# Altium project Resonator filter design.PrjPcb
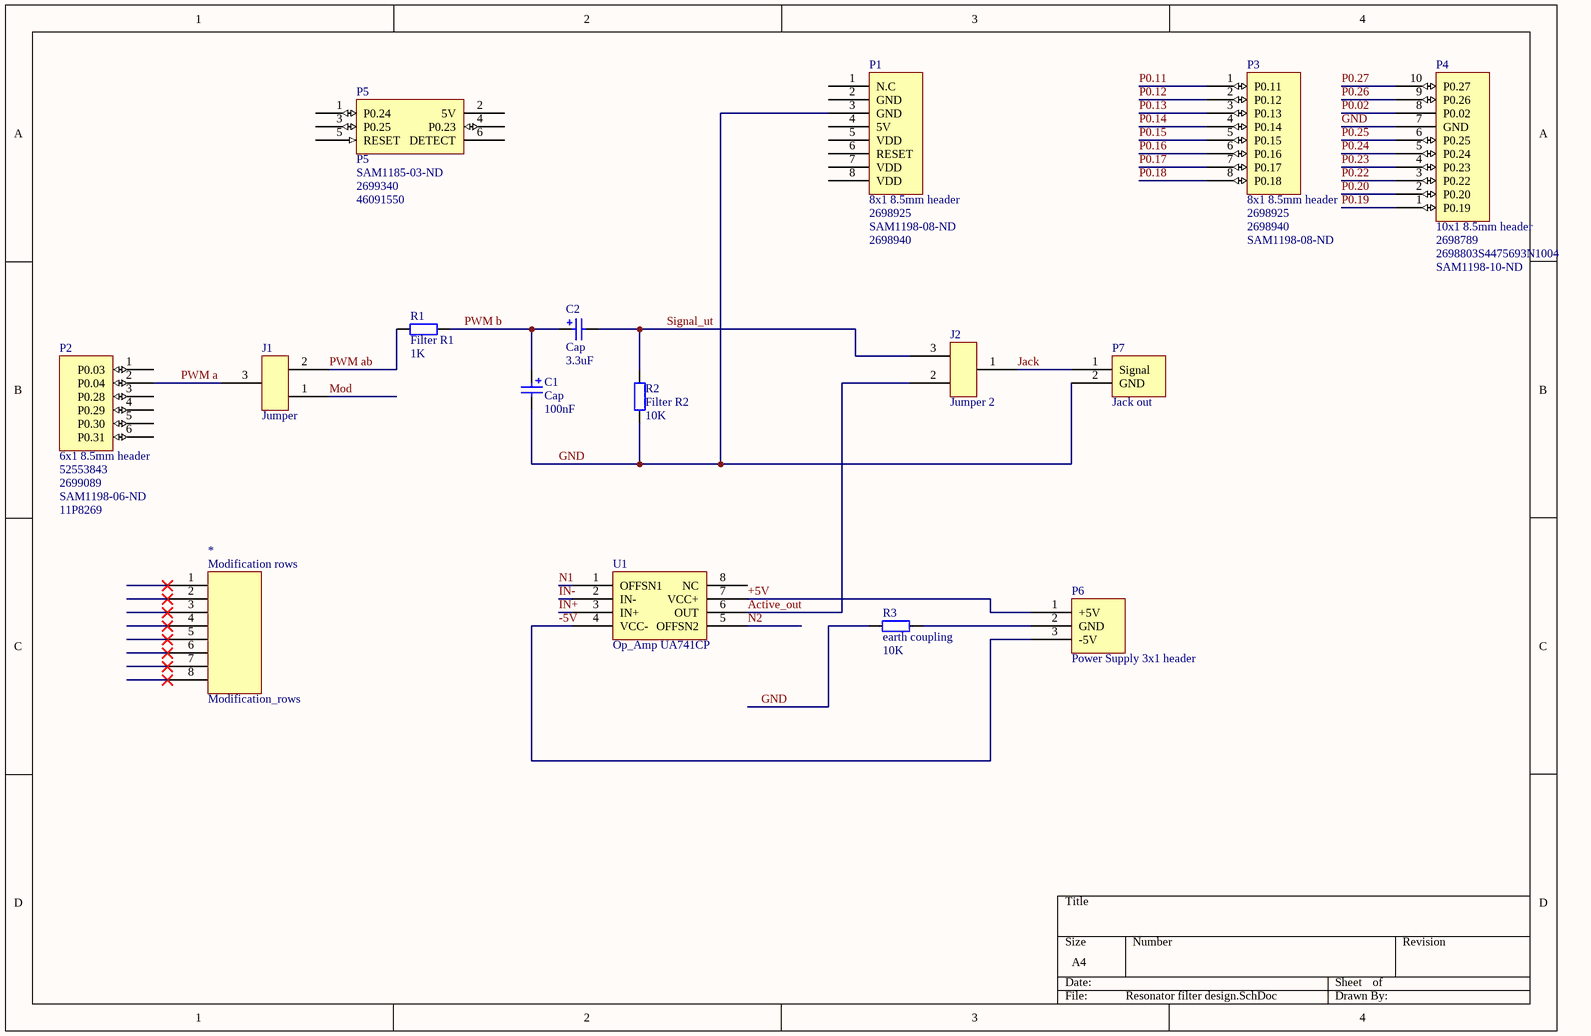
[diagram p0: Resonator filter design.SchDoc]
1 sheet, 16 parts. Net scope: global (net labels, ports and power ports of the same name join across sheets).
Board file: Resonator filter design.PcbDoc

## Sheet Resonator filter design.SchDoc
size A4

### Parts
*  Modification_rows
C1  Cap  value 100nF  [Cap 100nF]
C2  Cap  value 3.3uF  [Cap 3.3uF]
J1  Jumper  [Jumper]
J2  Jumper 2  [Jumper2]
P1  8x1 8.5mm header  Supplier Part Number 1: 2698925  Supplier Part Number 2: SAM1198-08-ND  Supplier Part Number 3: 2698940  [Header 8x1 8.5mm]
P2  6x1 8.5mm header  Supplier Part Number 1: 52553843  Supplier Part Number 2: 2699089  Supplier Part Number 3: SAM1198-06-ND  Supplier Part Number 4: 11P8269  [Header 6x1 8.5mm]
P3  8x1 8.5mm header  Supplier Part Number 1: 2698925  Supplier Part Number 2: 2698940  Supplier Part Number 3: SAM1198-08-ND  [Header 8x1 8.5mm]
P4  10x1 8.5mm header  Supplier Part Number 1: 2698789  Supplier Part Number 2: 2698803S4475693N1004  Supplier Part Number 3: SAM1198-10-ND  [Header 10x1 8.5mm]
P5  P5  Supplier Part Number 1: SAM1185-03-ND  Supplier Part Number 2: 2699340  Supplier Part Number 3: 46091550  [ICSP]
P6  Power Supply 3x1 header  [Power Supply connector]
P7  Jack out  [Jack out]
R1  Filter R1  value 1K  [AXIAL-0.4]
R2  Filter R2  value 10K  [AXIAL-0.4]
R3  earth coupling  value 10K  [AXIAL-0.4]
U1  Op_Amp UA741CP  [Op-Amp UA741CP]

### Nets
+5V: P6.1(+5V) U1.7(VCC+)
-5V: P6.3(-5V) U1.4(VCC-)
Active_out: J2.2 U1.6(OUT)
GND: C1.2 P1.3(GND) P4.7(GND) P7.2(GND) R2.1 R3.2
IN+: U1.3(IN+)
IN-: U1.2(IN-)
Jack: J2.1 P7.1(Signal)
Mod: J1.1
N1: U1.1(OFFSN1)
N2: U1.5(OFFSN2)
P0.02: P4.8(P0.02)
P0.11: P3.1(P0.11)
P0.12: P3.2(P0.12)
P0.13: P3.3(P0.13)
P0.14: P3.4(P0.14)
P0.15: P3.5(P0.15)
P0.16: P3.6(P0.16)
P0.17: P3.7(P0.17)
P0.18: P3.8(P0.18)
P0.19: P4.1(P0.19)
P0.20: P4.2(P0.20)
P0.22: P4.3(P0.22)
P0.23: P4.4(P0.23)
P0.24: P4.5(P0.24)
P0.25: P4.6(P0.25)
P0.26: P4.9(P0.26)
P0.27: P4.10(P0.27)
PWM a: J1.3 P2.2(P0.04)
PWM ab: J1.2 R1.1
PWM b: C1.1 C2.1 R1.2
Signal_ut: C2.2 J2.3 R2.2
NetP6_2: P6.2(GND) R3.1

Not connected (* = marked no-connect by the designer): * 1* 2* 3* 4* 5* 6* 7* 8*; P1 1(N.C) 2(GND) 4(5V) 5(VDD) 6(RESET) 7(VDD) 8(VDD); P2 1(P0.03) 3(P0.28) 4(P0.29) 5(P0.30) 6(P0.31); P5 1(P0.24) 2(5V) 3(P0.25) 4(P0.23) 5(RESET) 6(DETECT); U1 8(NC)

### Notes on the sheet
- (in symbol Modification_rows) Modification rows

### Library data of the parts
C1 C2 = Cap Pol2: Polarized Capacitor (Axial); Published: 8-Jun-2000; LatestRevisionDate: 17-Jul-2002; LatestRevisionNote: Re-released for DXP Platform.; PackageReference: POLAR0.8; Publisher: Altium Limited; PackageDescription: Polarized Capacitor; 2 Leads
P1 = POWER P1: Supplier 1: Arrow; Supplier 2: Digi-Key; Supplier 3: Arrow
P2 = P2: Supplier 1: Arrow; Supplier 2: Arrow; Supplier 3: Digi-Key; Supplier 4: Newark
P3 = P3: Supplier 1: Arrow; Supplier 2: Arrow; Supplier 3: Digi-Key
P4 = P4: Supplier 1: Arrow; Supplier 2: Arrow; Supplier 3: Digi-Key
P6 = Power Supply
R1-R3 = Res2: Resistor; Published: 8-Jun-2000; LatestRevisionDate: 17-Jul-2002; LatestRevisionNote: Re-released for DXP Platform.; PackageReference: AXIAL-0.4; Publisher: Altium Limited; PackageDescription: Axial Device, Thru-Hole; 2 Leads; 0.4 in Pin Spacing
P5 = P5: Supplier 1: Digi-Key; Supplier 2: Arrow; Supplier 3: Arrow